# EAGLE schematic Warmie Helper Board V.9.4 (GND EN 3.3v) (EAGLE 6.4)
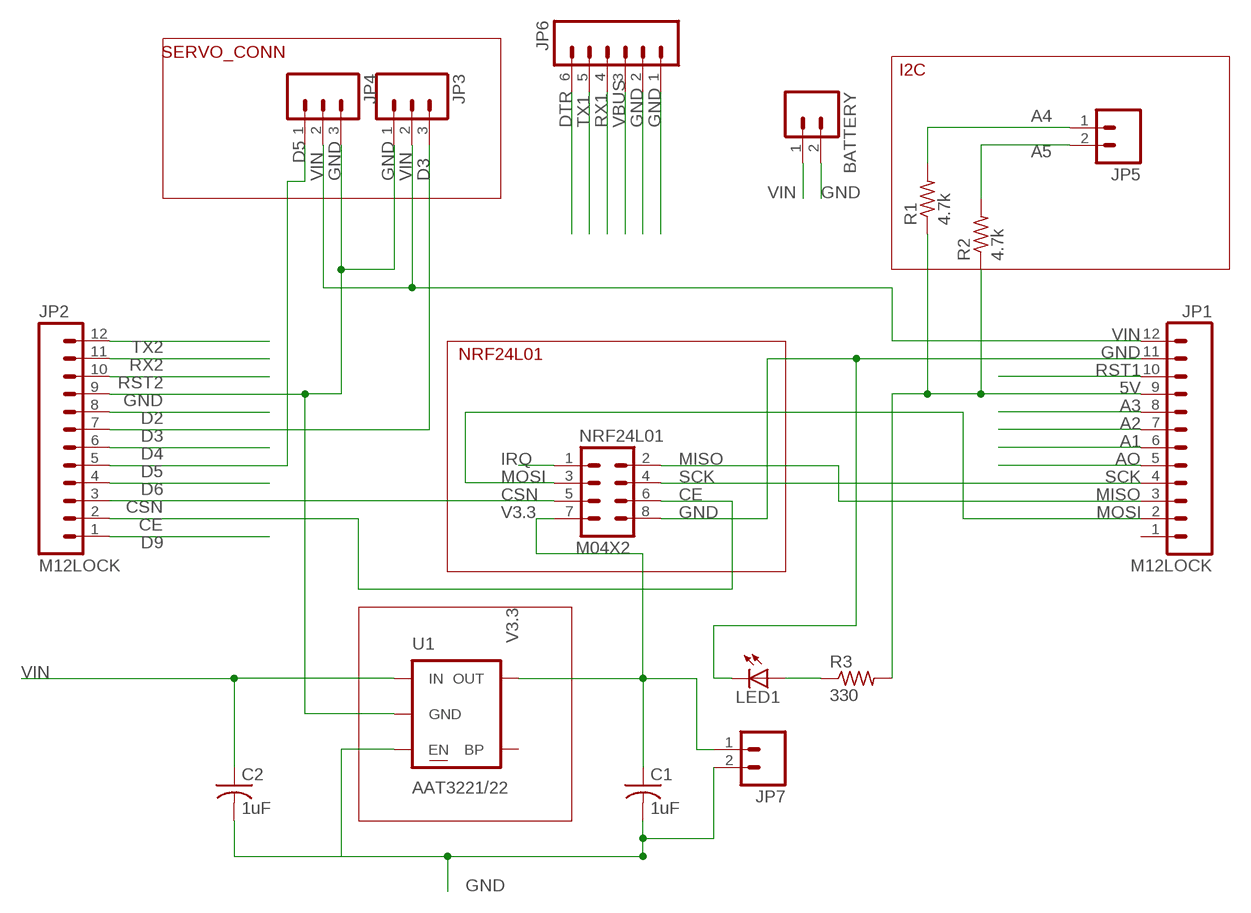
[diagram p0: schematic, sheet 1]

## Parts
BATTERY  M02LOCK  [1X02_LOCK]
C1  1uF  C-USC0805  [C0805]
C2  1uF  C-USC0805  [C0805]
JP1  M12LOCK  [1X12_LOCK]
JP2  M12LOCK  [1X12_LOCK]
JP3  M03LOCK  [1X03_LOCK]
JP4  M03LOCK  [1X03_LOCK]
JP5  M02LOCK  [1X02_LOCK]
JP6  M06LOCK  [1X06_LOCK]
JP7  M02LOCK  [1X02_LOCK]
LED1  LEDSML0603  [SML0603]
NRF24L01  M04X2  [2X4]
R1  4.7k  R-US_M0805  [M0805]
R2  4.7k  R-US_M0805  [M0805]
R3  330  R-US_M0805  [M0805]
U1  AAT3221/22  V_REG_LDOSMD  [SOT23-5]

## Nets
5V: JP1.9 R1.1 R2.1 R3.2
A1: JP1.6
A2: JP1.7
A3: JP1.8
A4: JP5.1 R1.2
A5: JP5.2 R2.2
AO: JP1.5
CE: JP2.2 NRF24L01.6
CSN: JP2.3 NRF24L01.5
D2: JP2.8
D3: JP2.7 JP3.3
D4: JP2.6
D5: JP2.5 JP4.1
D6: JP2.4
D9: JP2.1
DTR: JP6.6
GND: BATTERY.2 C1.2 C2.2 JP1.11 JP2.9 JP3.1 JP4.3 JP6.1 JP6.2 JP7.2 LED1.C NRF24L01.8 U1.2(GND) U1.3(EN)
IRQ: NRF24L01.1
MISO: JP1.3 NRF24L01.2
MOSI: JP1.2 NRF24L01.3
N$2: LED1.A R3.1
RST1: JP1.10
RST2: JP2.10
RX1: JP6.4
RX2: JP2.11
SCK: JP1.4 NRF24L01.4
TX1: JP6.5
TX2: JP2.12
V3.3: C1.1 JP7.1 NRF24L01.7 U1.5(OUT)
VBUS: JP6.3
VIN: BATTERY.1 C2.1 JP1.12 JP3.2 JP4.2 U1.1(IN)
Unconnected: JP1.1 U1.4(BP)

## Notes on the sheet
- SERVO_CONN
- I2C
- NRF24L01

## Library data of the parts
BATTERY JP5 JP7 = SparkFun:M02: Header 2 Standard 2-pin 0.1" header. Use with straight break away headers (SKU : PRT-00116), right angle break away headers (PRT-00553), swiss pins (PRT-00743), machine pins (PRT-00117), and female headers (PRT-00115). Molex polarized connector foot print use with SKU : PRT-08233 with associated crimp pins and housings.
C1 C2 = resistor:C-US: CAPACITOR, American symbol
JP1 JP2 = SparkFun:M12: Header 12 Standard 12-pin 0.1" header. Use with straight break away headers (SKU : PRT-00116), right angle break away headers (PRT-00553), swiss pins (PRT-00743), machine pins (PRT-00117), and female headers (PRT-00115).
JP3 JP4 = SparkFun:M03: Header 3 Standard 3-pin 0.1" header. Use with straight break away headers (SKU : PRT-00116), right angle break away headers (PRT-00553), swiss pins (PRT-00743), machine pins (PRT-00117), and female headers (PRT-00115). Molex polarized connector foot print use with SKU : PRT-08232 with associated crimp pins and housings.
JP6 = SparkFun:M06: Header 6 Standard 6-pin 0.1" header. Use with straight break away headers (SKU : PRT-00116), right angle break away headers (PRT-00553), swiss pins (PRT-00743), machine pins (PRT-00117), and female headers (PRT-00115). Molex polarized connector foot print use with SKU : PRT-08094 with associated crimp pins and housings. NOTES ON THE VARIANTS LOCK and LOCK_LONGPADS... This footprint was designed to help hold the alignment of a through-hole component (i.e. 6-pin header) while soldering it into place. You may notice that each hole has been shifted either up or down by 0.005 of an inch from it's more standard position (which is a perfectly straight line). This slight alteration caused the pins (the squares in the middle) to touch the edges of the holes. Because they are alternating, it causes a "brace" to hold the component in place. 0.005 has proven to be the perfect amount of "off-center" position when using our standard breakaway headers. Although looks a little odd when you look at the bare footprint, once you have a header in there, the alteration is very hard to notice. Also, if you push a header all the way into place, it is covered up entirely on the bottom side. This idea of altering the position of holes to aid alignment will be further integrated into the Sparkfun Library for other footprints. It can help hold any component with 3 or more connection pins.
LED1 = led:LED: LED OSRAM: - CHIPLED LG R971, LG N971, LY N971, LG Q971, LY Q971, LO R971, LY R971 LH N974, LH R974 LS Q976, LO Q976, LY Q976 LO Q996 - Hyper CHIPLED LW Q18S LB Q993, LB Q99A, LB R99A - SideLED LS A670, LO A670, LY A670, LG A670, LP A670 LB A673, LV A673, LT A673, LW A673 LH A674 LY A675 LS A676, LA A676, LO A676, LY A676, LW A676 LS A679, LY A679, LG A679 - Hyper Micro SIDELED® LS Y876, LA Y876, LO Y876, LY Y876 LT Y87S - SmartLED LW L88C, LW L88S LB L89C, LB L89S, LG L890 LS L89K, LO L89K, LY L89K LS L896, LA L896, LO L896, LY L896 - TOPLED LS T670, LO T670, LY T670, LG T670, LP T670 LSG T670, LSP T670, LSY T670, LOP T670, LYG T670 LG T671, LOG T671, LSG T671 LB T673, LV T673, LT T673, LW T673 LH T674 LS T676, LA T676, LO T676, LY T676, LB T676, LH T676, LSB T676, LW T676 LB T67C, LV T67C, LT T67C, LS T67K, LO T67K, LY T67K, LW E67C LS E67B, LA E67B, LO E67B, LY E67B, LB E67C, LV E67C, LT E67C LW T67C LS T679, LY T679, LG T679 LS T770, LO T770, LY T770, LG T770, LP T770 LB T773, LV T773, LT T773, LW T773 LH T774 LS E675, LA E675, LY E675, LS T675 LS T776, LA T776, LO T776, LY T776, LB T776 LHGB T686 LT T68C, LB T68C - Hyper Mini TOPLED® LB M676 - Mini TOPLED Santana® LG M470 LS M47K, LO M47K, LY M47K Source: http://www.osram.convergy.de LUXEON: - LUMILED® LXK2-PW12-R00, LXK2-PW12-S00, LXK2-PW14-U00, LXK2-PW14-V00 LXK2-PM12-R00, LXK2-PM12-S00, LXK2-PM14-U00 LXK2-PE12-Q00, LXK2-PE12-R00, LXK2-PE12-S00, LXK2-PE14-T00, LXK2-PE14-U00 LXK2-PB12-K00, LXK2-PB12-L00, LXK2-PB12-M00, LXK2-PB14-N00, LXK2-PB14-P00, LXK2-PB14-Q00 LXK2-PR12-L00, LXK2-PR12-M00, LXK2-PR14-Q00, LXK2-PR14-R00 LXK2-PD12-Q00, LXK2-PD12-R00, LXK2-PD12-S00 LXK2-PH12-R00, LXK2-PH12-S00 LXK2-PL12-P00, LXK2-PL12-Q00, LXK2-PL12-R00 Source: www.luxeon.com KINGBRIGHT: KA-3528ASYC Source: www.kingbright.com
NRF24L01 = SparkFun:M04X2
R1-R3 = resistor:R-US_: RESISTOR, American symbol
U1 = SparkFun:V_REG_LDO: Voltage Regulator LDO Standard 150mA LDO voltage regulator in SOT-23 layout. Micrel part MIC5205. BP (by-pass) pin is used to lower output noise with 470pF cap.